# Altium schematic sheet Sheet1.SchDoc
size A3; SheetNumber: 2; SheetTotal: 6
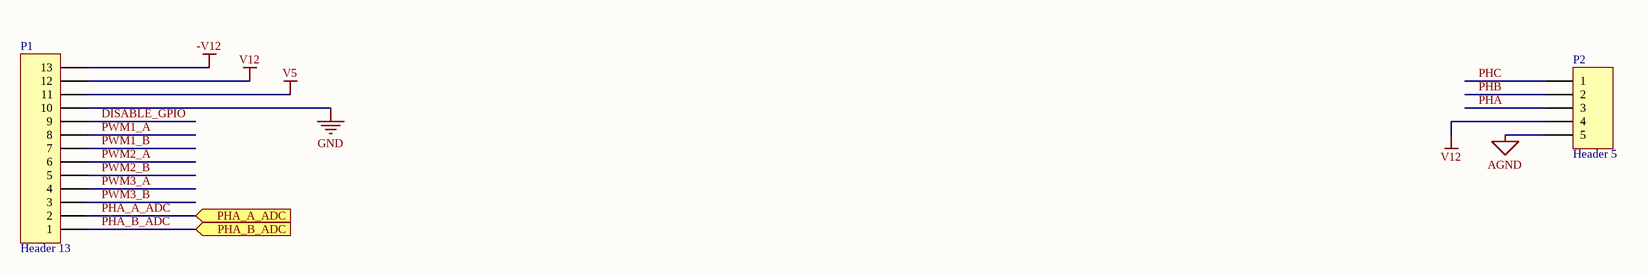
[diagram p0: Sheet1.SchDoc]

## Parts
P1  Header 13  [HDR1X13]
P2  Header 5  [HDR1X5]

## Ports
PHA_A_ADC (in), PHA_B_ADC (in)

## Nets
-V12: P1.13
AGND: P2.5
GND: P1.10
V5: P1.11
V12: P1.12 P2.4
DISABLE_GPIO: P1.9
PHA: P2.3
PHA_A_ADC: P1.2 ; port PHA_A_ADC
PHA_B_ADC: P1.1 ; port PHA_B_ADC
PHB: P2.2
PHC: P2.1
PWM1_A: P1.8
PWM1_B: P1.7
PWM2_A: P1.6
PWM2_B: P1.5
PWM3_A: P1.4
PWM3_B: P1.3

## Library data of the parts
P1 = Header 13: Header, 13-Pin; LatestRevisionDate: 17-Jul-2002; LatestRevisionNote: Re-released for DXP Platform.; Publisher: Altium Limited
P2 = Header 5: Header, 5-Pin; LatestRevisionDate: 17-Jul-2002; LatestRevisionNote: Re-released for DXP Platform.; Publisher: Altium Limited